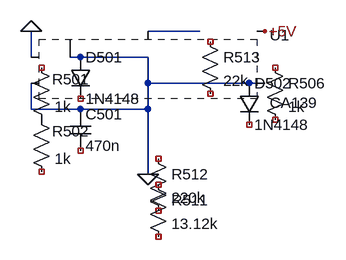
[diagram p0: schematic td_comparator.asc]
td_comparator.asc, the LTspice schematic file:
Version 4
SHEET 1 880 680
FLAG 80 80 0
SYMBOL res 80 120 R0
WINDOW 0 32 34 Left 2
SYMATTR InstName R501
SYMATTR Value 1k
SYMBOL res 80 200 R0
WINDOW 0 32 34 Left 2
SYMATTR InstName R502
SYMATTR Value 1k
SYMBOL cap 140 200 R0
SYMATTR InstName C501
SYMATTR Value 470n
SYMBOL diode 140 120 R0
SYMATTR InstName D501
SYMATTR Value 1N4148

SYMBOL opamp2 260 160 R0
SYMATTR InstName U1
SYMATTR Value CA139

SYMBOL res 340 80 R0
SYMATTR InstName R513
SYMATTR Value 22k

SYMBOL res 260 260 R0
SYMATTR InstName R512
SYMATTR Value 220k

SYMBOL res 260 300 R0
SYMATTR InstName R511
SYMATTR Value 13.12k

SYMBOL diode 400 160 R0
SYMATTR InstName D502
SYMATTR Value 1N4148

SYMBOL res 440 120 R0
SYMATTR InstName R506
SYMATTR Value 1k

WIRE 80 80 80 120
WIRE 80 160 80 200
WIRE 80 200 140 200
WIRE 140 200 260 200
WIRE 140 120 260 120
WIRE 260 120 260 160
WIRE 260 160 260 260
WIRE 260 260 260 300
WIRE 340 80 260 80
WIRE 260 160 400 160
WIRE 400 160 440 160

FLAG 260 300 0
FLAG 440 80 +5V

The netlist it stands for:
* td_comparator.asc
R501 NC_01 P001 1k
R502 P001 NC_02 1k
C501 0 NC_03 470n
D501 0 NC_04 1N4148
* U1: CA139 (symbol opamp2 not available, pin order unknown); nets seen at it: +5V, 0, N001
R513 NC_05 NC_06 22k
R512 NC_07 NC_08 220k
R511 NC_09 NC_10 13.12k
D502 0 NC_11 1N4148
R506 NC_12 NC_13 1k
.model D D
.lib standard.dio
.backanno
.end